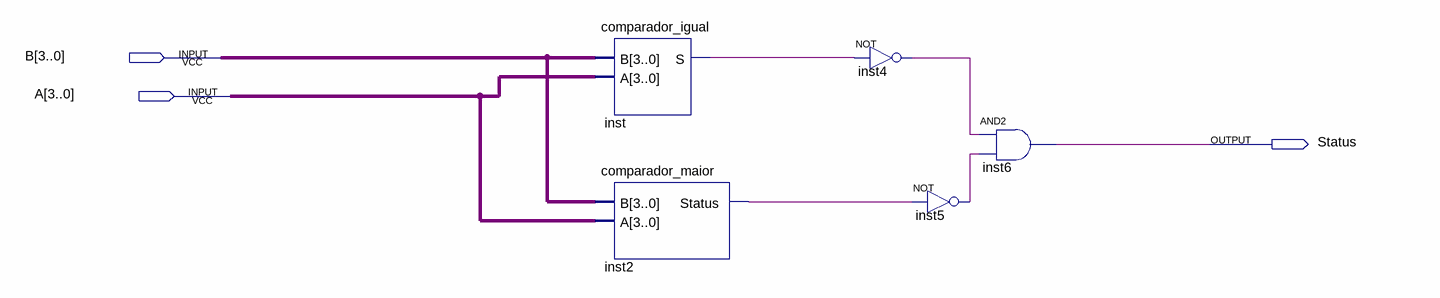
[diagram p0: schematic sheet]
// Quartus schematic comparador_menor.bdf as structural Verilog: 5 symbols, 3 pins
module comparador_menor (
  input  [3:0] B,
  input  [3:0] A,
  output Status
);

  wire inst2_status, inst4_out, inst5_out, inst_s;

  comparador_igual inst (.B(B), .A(A), .S(inst_s));
  comparador_maior inst2 (.B(B), .A(A), .Status(inst2_status));
  not inst4 (inst4_out, inst_s);
  not inst5 (inst5_out, inst2_status);
  and inst6 (Status, inst4_out, inst5_out);
endmodule
